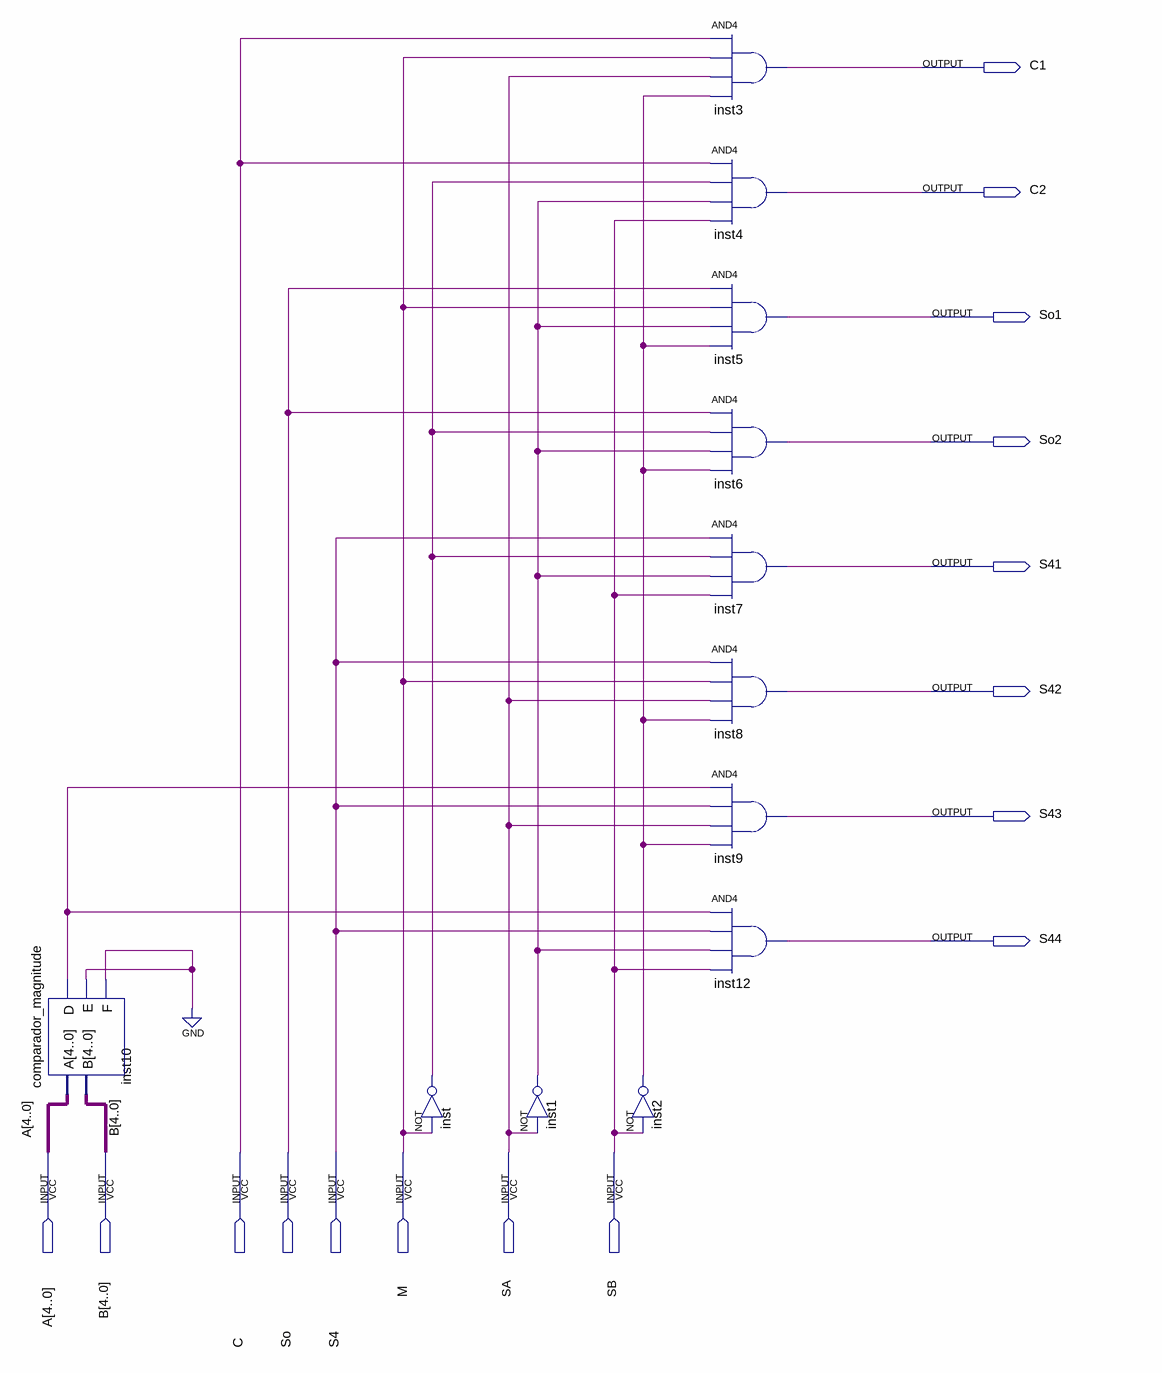
[diagram p0: schematic sheet]
// Quartus schematic circuito_cary.bdf as structural Verilog: 12 symbols, 16 pins
module circuito_cary (
  input  [4:0] A,
  input  [4:0] B,
  input  C,
  input  So,
  input  S4,
  input  M,
  input  SA,
  input  SB,
  output C1,
  output C2,
  output So1,
  output So2,
  output S41,
  output S42,
  output S43,
  output S44
);

  wire inst1_out, inst2_out, inst10_d, inst10_e, inst_out;

  comparador_magnitude inst10 (.A(A), .B(B), .D(inst10_d), .E(inst10_e), .F(inst10_e));
  not inst (inst_out, M);
  not inst1 (inst1_out, SA);
  not inst2 (inst2_out, SB);
  and inst3 (C1, C, M, SA, inst2_out);
  and inst4 (C2, C, inst_out, inst1_out, SB);
  and inst5 (So1, So, M, inst1_out, inst2_out);
  and inst6 (So2, So, inst_out, inst1_out, inst2_out);
  and inst7 (S41, S4, inst_out, inst1_out, SB);
  and inst8 (S42, S4, M, SA, inst2_out);
  and inst9 (S43, inst10_d, S4, SA, inst2_out);
  and inst12 (S44, inst10_d, S4, inst1_out, SB);
  // also tied to GND on the sheet: inst10_e
endmodule
